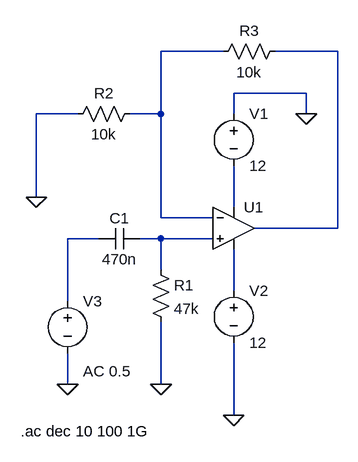
[diagram p0: schematic Frequency Response.asc]
Frequency Response.asc, the LTspice schematic file:
Version 4
SHEET 1 880 680
WIRE 160 -208 64 -208
WIRE 336 -208 240 -208
WIRE 288 -144 176 -144
WIRE -64 -112 -128 -112
WIRE 64 -112 64 -208
WIRE 64 -112 16 -112
WIRE 176 -112 176 -144
WIRE 288 -112 288 -144
WIRE -128 16 -128 -112
WIRE 176 32 176 -32
WIRE 64 48 64 -112
WIRE 144 48 64 48
WIRE 336 64 336 -208
WIRE 336 64 208 64
WIRE -32 80 -80 80
WIRE 64 80 32 80
WIRE 144 80 64 80
WIRE 64 128 64 80
WIRE 176 160 176 96
WIRE -80 176 -80 80
WIRE -80 304 -80 256
WIRE 64 304 64 208
WIRE 176 352 176 240
FLAG 288 -112 0
FLAG 176 352 0
FLAG 64 304 0
FLAG -80 304 0
FLAG -128 16 0
SYMBOL voltage 176 -128 R0
WINDOW 123 0 0 Left 0
WINDOW 39 0 0 Left 0
SYMATTR InstName V1
SYMATTR Value 12
SYMBOL voltage 176 144 R0
WINDOW 123 0 0 Left 0
WINDOW 39 0 0 Left 0
SYMATTR InstName V2
SYMATTR Value 12
SYMBOL OpAmps\\UniversalOpamp2 176 64 R0
SYMATTR InstName U1
SYMBOL res 48 112 R0
SYMATTR InstName R1
SYMATTR Value 47k
SYMBOL cap 32 64 R90
WINDOW 0 0 32 VBottom 2
WINDOW 3 32 32 VTop 2
SYMATTR InstName C1
SYMATTR Value 470n
SYMBOL voltage -80 160 R0
WINDOW 123 24 124 Left 2
WINDOW 39 0 0 Left 0
SYMATTR Value2 AC 0.5
SYMATTR InstName V3
SYMATTR Value ""
SYMBOL res 32 -128 R90
WINDOW 0 0 56 VBottom 2
WINDOW 3 32 56 VTop 2
SYMATTR InstName R2
SYMATTR Value 10k
SYMBOL res 256 -224 R90
WINDOW 0 0 56 VBottom 2
WINDOW 3 32 56 VTop 2
SYMATTR InstName R3
SYMATTR Value 10k
TEXT -152 376 Left 2 !.ac dec 10 100 1G

The netlist it stands for:
* Frequency Response.asc
V1 0 N003 12
V2 N006 0 12
XU1 N005 N001 N003 N006 N002 level.2 Avol=1Meg GBW=10Meg Slew=10Meg ilimit=25m rail=0 Vos=0 phimargin=45 en=0 enk=0 in=0 ink=0 Rin=500Meg  ; pins IN+ IN- V+ V- OUT
R1 N005 0 47k
C1 N005 N004 470n
V3 N004 0 AC 0.5
R2 N001 0 10k
R3 N002 N001 10k
.ac dec 10 100 1G
.lib UniversalOpamps2.sub
.backanno
.end